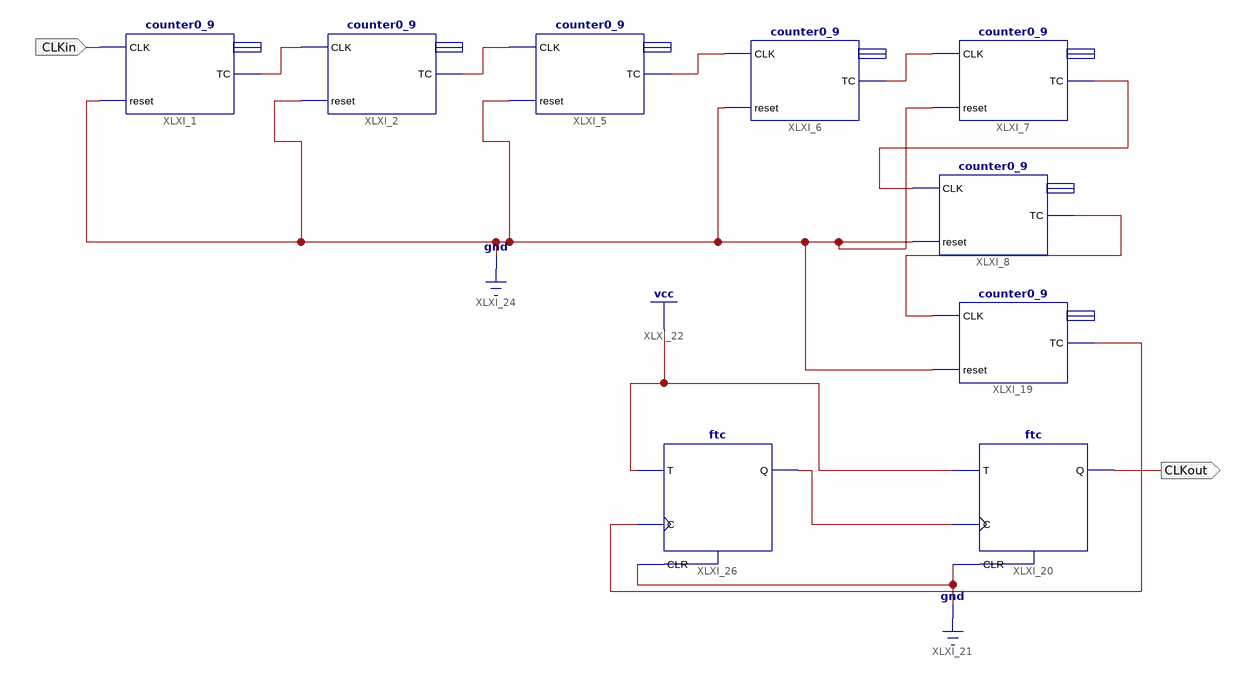
[diagram p0: schematic sheet 1]
// Xilinx ISE schematic div20M.sch (spartan6) as structural Verilog: 9 symbols, 2 ports
module div20M (
  input  CLKin,
  output CLKout
);

  wire XLXN_2, XLXN_3, XLXN_4, XLXN_5, XLXN_6, XLXN_7, XLXN_28, XLXN_30;

  counter0_9 XLXI_8 (.reset(1'b0), .CLK(XLXN_6), .TC(XLXN_7));  // open: C
  counter0_9 XLXI_1 (.reset(1'b0), .CLK(CLKin), .TC(XLXN_2));  // open: C
  counter0_9 XLXI_2 (.reset(1'b0), .CLK(XLXN_2), .TC(XLXN_3));  // open: C
  counter0_9 XLXI_5 (.reset(1'b0), .CLK(XLXN_3), .TC(XLXN_4));  // open: C
  counter0_9 XLXI_6 (.reset(1'b0), .CLK(XLXN_4), .TC(XLXN_5));  // open: C
  counter0_9 XLXI_7 (.reset(1'b0), .CLK(XLXN_5), .TC(XLXN_6));  // open: C
  counter0_9 XLXI_19 (.reset(1'b0), .CLK(XLXN_7), .TC(XLXN_30));  // open: C
  ftc XLXI_20 (.C(XLXN_28), .CLR(1'b0), .T(1'b1), .Q(CLKout));
  ftc XLXI_26 (.C(XLXN_30), .CLR(1'b0), .T(1'b1), .Q(XLXN_28));
endmodule
